# EAGLE schematic schematic (EAGLE 7.3.0)
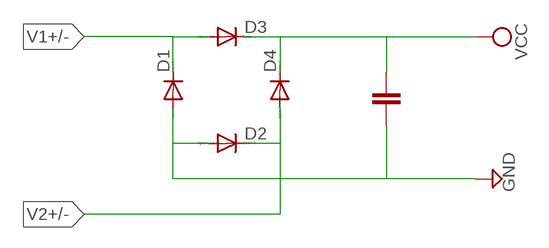
[diagram p0: schematic, sheet 1]

## Parts
D1  1N4004  [DO41-10]
D2  1N4004  [DO41-10]
D3  1N4004  [DO41-10]
D4  1N4004  [DO41-10]

## Nets
GND: D1.A D2.A
V1+/-: D1.C D3.A
V2+/-: D2.C D4.A
VCC: D3.C D4.C

## Library data of the parts
D1-D4 = diode:1N4004: DIODE general purpose rectifier, 1 A